# Altium project PCB_Project_1.PrjPcb
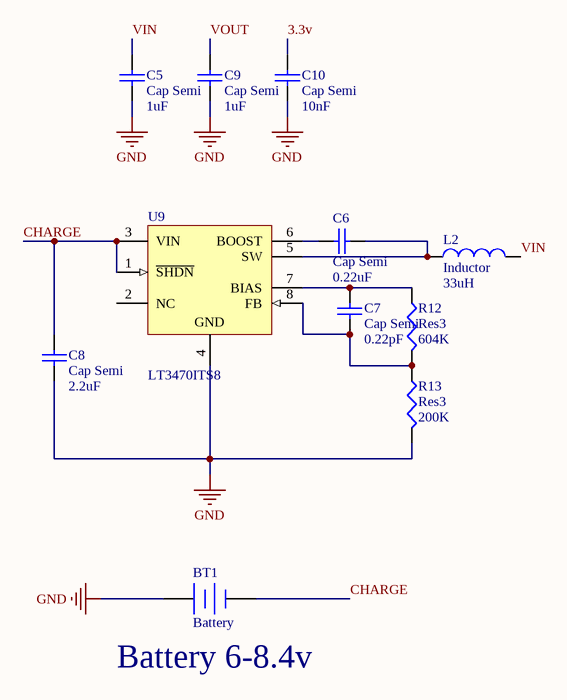
[diagram p0: 5v and Filters.SchDoc]
3 sheets, 52 parts. Net scope: global (net labels, ports and power ports of the same name join across sheets).
Board file: Breakout.PcbDoc
Sheets:
  5v and Filters.SchDoc
  PocketPilot.SchDoc
  MPPT.SchDoc

## Sheet 5v and Filters.SchDoc
size A4; SheetNumber: 1; SheetTotal: 3

### Parts
BT1  Battery  [BAT-2]
C5  Cap Semi  value 1uF  [C1206]
C6  Cap Semi  value 0.22uF  [C1206]
C7  Cap Semi  value 0.22pF  [C1206]
C8  Cap Semi  value 2.2uF  [C1206]
C9  Cap Semi  value 1uF  [C1206]
C10  Cap Semi  value 10nF  [C1206]
L2  Inductor  value 33uH  [0402-A]
R12  Res3  value 604K  [J1-0603]
R13  Res3  value 200K  [J1-0603]
U9  LT3470ITS8  [LT-TS8-8-TSOT-23_V]

### Nets
GND: BT1.1(+) C5.1 C8.2 C9.1 C10.1 R13.2 U9.4(GND)
3.3v: C10.2
CHARGE: BT1.2(-) C8.1 U9.1(~{SHDN}) U9.3(VIN)
VIN: C5.2 L2.2
VOUT: C9.2
NetC6_1: C6.1 U9.6(BOOST)
NetC6_2: C6.2 L2.1 U9.5(SW)
NetC7_1: C7.1 R12.1 U9.7(BIAS)
NetC7_2: C7.2 R12.2 R13.1 U9.8(FB)

Not connected (* = marked no-connect by the designer): U9 2(NC)

### Notes on the sheet
- (near BT1) Battery 6-8.4v

### Library data of the parts
BT1 = Battery: Multicell Battery; Published: 24-Mar-1999; LatestRevisionDate: 17-Jul-2002; LatestRevisionNote: Re-released for DXP Platform.; PackageReference: BAT-2; Publisher: Altium Limited; PackageDescription: Battery; 2 Leads
C5-C10 = Cap Semi: Capacitor (Semiconductor SIM Model); Published: 8-Jun-2000; LatestRevisionDate: 29-May-2009; LatestRevisionNote: IPC-7351 Footprint Added.; PackageReference: C1206; Publisher: Altium Limited; PackageDescription: Chip Capacitor
L2 = Inductor: Code_IEC: 1005; Published: 8-Jun-2000; LatestRevisionDate: 29-May-2009; LatestRevisionNote: IPC-7351 Footprint Added.; PackageReference: 0402-A; Publisher: Altium Limited; PackageDescription: Chip Inductor; Code_JEITA: 0402
R12 R13 = Res3: Resistor; Published: 8-Jun-2000; LatestRevisionDate: 29-May-2009; LatestRevisionNote: IPC-7351 Footprint Added.; PackageReference: J1-0603; Publisher: Altium Limited; PackageDescription: Chip Resistor
U9 = CMP-0491-02134-1: Micropower Buck Regulator with Integrated Boost and Catch Diode, 8-pin SOT23 (TS8-8), -40 to 125 degC; Manufacturer: Linear Technology; Number of Outputs: 1; PackageVersion: Rev. A, 08/2010; ComponentLink1Description: Manufacturer URL; PartNumber: LT3470ITS8; DatasheetVersion: Rev. D; ComponentLink3Description: Package Specification; ComponentLink3URL: http://cds.linear.com/docs/en/packaging/SOT_8_05-08-1637.pdf; ComponentLink2URL: http://cds.linear.com/docs/en/datasheet/3470fd.pdf; PackageDescription: 8-Pin Plastic TSOT-23, Body 2.9 x 1.63 mm, Pitch 0.65 mm; PackageReference: TS8-8; ComponentLink2Description: Datasheet; ComponentLink1URL: http://www.linear.com/; Code_JEDEC: MO-193; Mounting Technology: Surface Mount; RoHS: FALSE

## Sheet PocketPilot.SchDoc
size A4; SheetNumber: 2; SheetTotal: 3
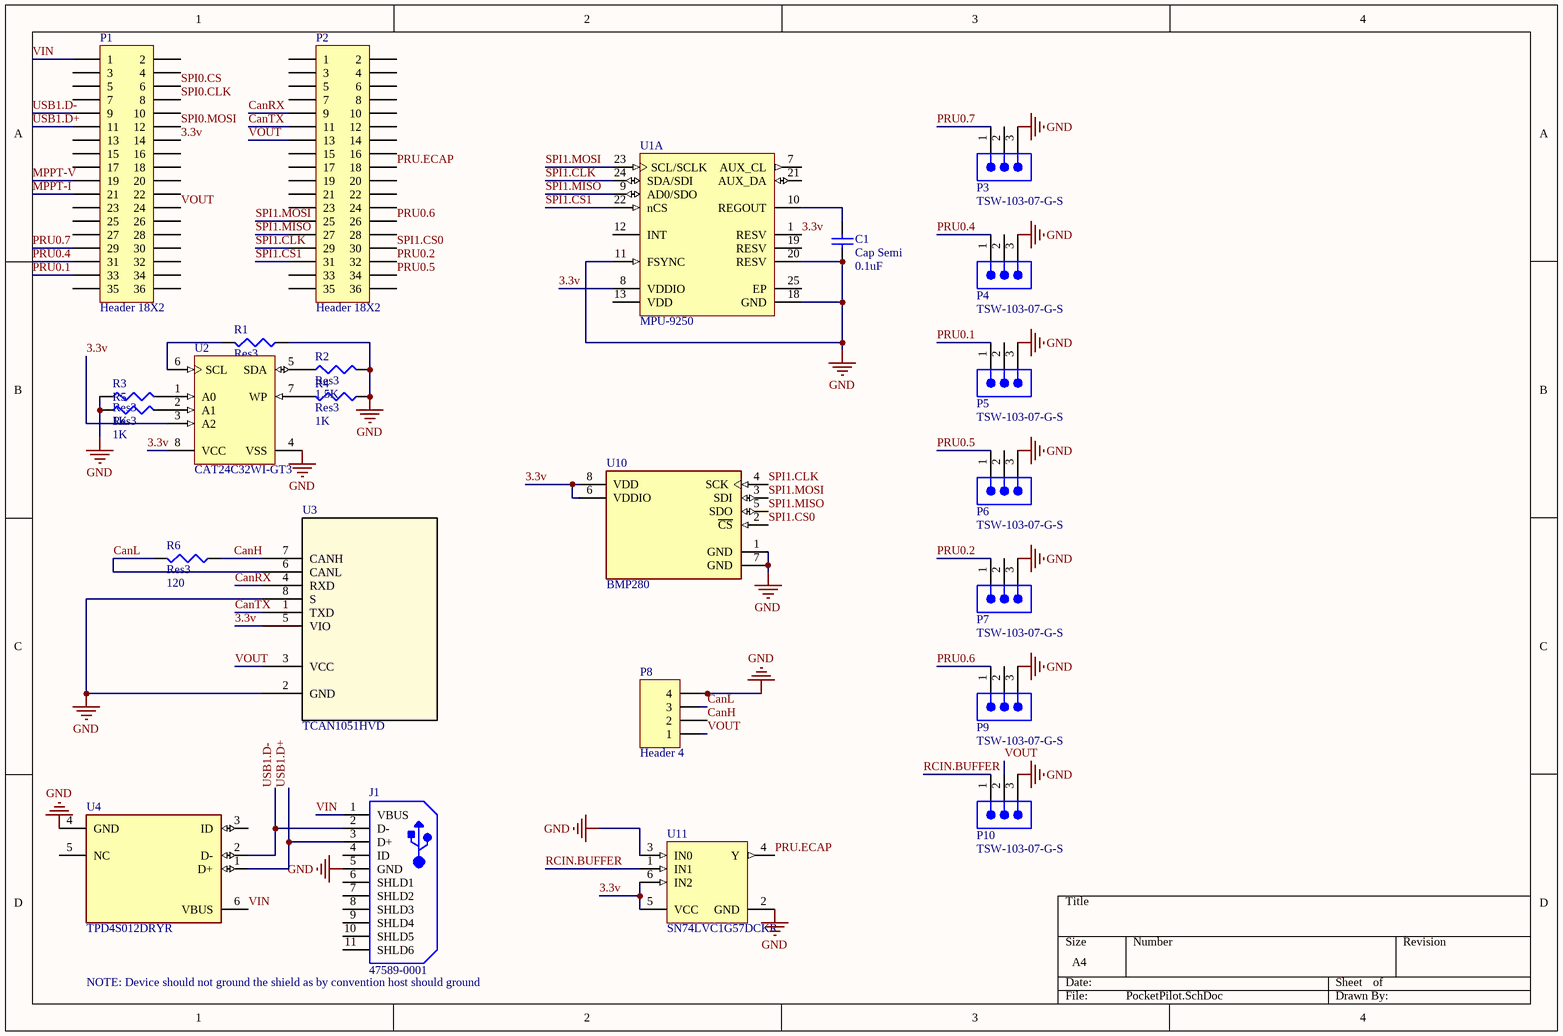
[diagram p1: PocketPilot.SchDoc]

### Parts
C1  Cap Semi  value 0.1uF  [C1206]
J1  47589-0001  [MOLX-47589-0001_V]
P1  Header 18X2  [HDR2X18]
P2  Header 18X2  [HDR2X18]
P3  TSW-103-07-G-S  [SMTC-TSW-103-07-X-S]
P4  TSW-103-07-G-S  [SMTC-TSW-103-07-X-S]
P5  TSW-103-07-G-S  [SMTC-TSW-103-07-X-S]
P6  TSW-103-07-G-S  [SMTC-TSW-103-07-X-S]
P7  TSW-103-07-G-S  [SMTC-TSW-103-07-X-S]
P8  Header 4  [HDR1X4]
P9  TSW-103-07-G-S  [SMTC-TSW-103-07-X-S]
P10  TSW-103-07-G-S  [SMTC-TSW-103-07-X-S]
R1  Res3  value 1.5K  [J1-0603]
R2  Res3  value 1.5K  [J1-0603]
R3  Res3  value 1K  [J1-0603]
R4  Res3  value 1K  [J1-0603]
R5  Res3  value 1K  [J1-0603]
R6  Res3  value 120  [J1-0603]
U1  MPU-9250  [INSE-QFN-24-1700X1540TP_M]  (part A of 2)
U2  CAT24C32WI-GT3  [ONSC-SOIC-8-751BD-01_M]
U3  TCAN1051HVD  [D8_TEX]
U4  TPD4S012DRYR  [FP-DRY0006A-MFG]
U10  BMP280  [FP-BMP280-MFG]
U11  SN74LVC1G57DCKR  [DCK0006A_N]

### Nets
GND: C1.1 J1.5(GND) P3.3 P4.3 P5.3 P6.3 P7.3 P8.4 P9.3 P10.3 R1.1 R2.2 R3.1 R4.1 R5.1 U1.11(FSYNC) U1.18(GND) U1.20(RESV) U2.4(VSS) U3.2(GND) U3.8(S) U4.4(GND) U10.1(GND) U10.7(GND) U11.2(GND) U11.3(IN0)
3.3v: P1.14 U1.1(RESV) U1.8(VDDIO) U2.3(A2) U2.8(VCC) U3.5(VIO) U10.6(VDDIO) U10.8(VDD) U11.5(VCC) U11.6(IN2)
CanH: P8.2 R6.1 U3.7(CANH)
CanL: P8.3 R6.2 U3.6(CANL)
CanRX: P2.9 U3.4(RXD)
CanTX: P2.11 U3.1(TXD)
MPPT-I: P1.21
MPPT-V: P1.19
PRU0.1: P1.33 P5.1
PRU0.2: P2.32 P7.1
PRU0.4: P1.31 P4.1
PRU0.5: P2.34 P6.1
PRU0.6: P2.26 P9.1
PRU0.7: P1.29 P3.1
PRU.ECAP: P2.18 U11.4(Y)
RCIN.BUFFER: P10.1 U11.1(IN1)
SPI0.CLK: P1.8
SPI0.CS: P1.6
SPI0.MOSI: P1.12
SPI1.CLK: P2.29 U1.24(SDA/SDI) U10.4(SCK)
SPI1.CS0: P2.30 U10.2(~{CS})
SPI1.CS1: P2.31 U1.22(nCS)
SPI1.MISO: P2.27 U1.9(AD0/SDO) U10.5(SDO)
SPI1.MOSI: P2.25 U1.23(SCL/SCLK) U10.3(SDI)
USB1.D+: J1.3(D+) P1.11 U4.1(D+)
USB1.D-: J1.2(D-) P1.9 U4.2(D-)
VIN: J1.1(VBUS) P1.1 U4.6(VBUS)
VOUT: P1.24 P2.13 P8.1 P10.2 U3.3(VCC)
NetC1_2: C1.2 U1.10(REGOUT)
NetR1_2: R1.2 U2.6(SCL)
NetR2_1: R2.1 U2.5(SDA)
NetR3_2: R3.2 U2.1(A0)
NetR4_2: R4.2 U2.7(WP)
NetR5_2: R5.2 U2.2(A1)

Not connected (* = marked no-connect by the designer): J1 4(ID) 6(SHLD1) 7(SHLD2) 8(SHLD3) 9(SHLD4) 10(SHLD5) 11(SHLD6); P1 2 3 4 5 7 10 13 15 16 17 18 20 22 23 25 26 27 28 30 32 34 35 36; P2 1 2 3 4 5 6 7 8 10 12 14 15 16 17 19 20 21 22 23 24 28 33 35 36; P3 2; P4 2; P5 2; P6 2; P7 2; P9 2; U1 7(AUX_CL) 12(INT) 13(VDD) 19(RESV) 21(AUX_DA) 25(EP); U4 3(ID) 5(NC)

### Notes on the sheet
- (near J1) NOTE: Device should not ground the shield as by convention host should ground

### Library data of the parts
C1 = Cap Semi: Capacitor (Semiconductor SIM Model); Published: 8-Jun-2000; LatestRevisionDate: 29-May-2009; LatestRevisionNote: IPC-7351 Footprint Added.; PackageReference: C1206; Publisher: Altium Limited; PackageDescription: Chip Capacitor
J1 = CMP-2000-05610-1: Right Angle Female Type AB Micro USB Connector, 30 V, 1.8 A, -30 to 85 degC, RoHS, Tape and Reel; Number of Ports: 1Port; Current Rating: 1.8A; Brand: Molex; Connector Type: MicroUSBTypeABreceptacle; Number of Contacts: 5Contact; Voltage Rating: 30VAC; Color: Black; Product: MicroUSBTypeABConnectors; Package URL: http://www.molex.com/pdm_docs/sd/475890001_sd.pdf; Contact Plating: Gold; Datasheet URL: http://www.molex.com/webdocs/datasheets/pdf/en-us/0475890001_IO_CONNECTORS.pdf; Operating Temperature Range: -20Cto+85C; Termination Style: SMD/SMT; Mounting Angle: Right; Package Reference: 47589-0001; Gender: Female; Package Description: Micro USB Connector, Pitch 0.65 mm, 5 Positions, Body 7.5 x 5.6 mm; Mounting Technology: SurfaceMount; Contact Material: CopperAlloy; Packaging: Reel; RoHS: True; Standard: USB; Manufacturer URL: http://www.molex.com/; Manufacturer: Molex; Datasheet Version: 12/2016; Product Category: USBConnectors; Series: 47589
P1 P2 = Header 18X2: Header, 18-Pin, Dual row; LatestRevisionDate: 17-Jul-2002; LatestRevisionNote: Re-released for DXP Platform.; Publisher: Altium Limited
P3-P7 P9 P10 = CMP-1024-00333-1: 0.025" SQ Post Header, Through-hole, Vertical, -55 to 125 degC, 2.54 mm Pitch, 3-Pin, Male, RoHS; Manufacturer: Samtec; Pitch: 2.54 mm; ComponentLink3URL: http://www.samtec.com/documents/webfiles/cpdf/TSW-XXX-XX-XXX-X-XX-XXX-MKT.pdf; Temperature Range: -55 to 125 degC; DatasheetVersion: F-214; ComponentLink1Description: Manufacturer URL; ComponentLink2URL: http://www.samtec.com/documents/webfiles/pdf/TSW_TH.PDF; RoHS: True; Orientation: Vertical; ComponentLink2Description: Datasheet; ComponentLink3Description: Package Specification; PackageDescription: .025[0.64] SQ. Post Terminal Strip Assembly; Mounting Technology: Through-hole; PackageVersion: DM, 8/1988; ComponentLink1URL: http://www.samtec.com; PackageReference: TSW-103-07-X-S; PartNumber: TSW-103-07-G-S
P8 = Header 4: Header, 4-Pin; LatestRevisionDate: 17-Jul-2002; LatestRevisionNote: Re-released for DXP Platform.; Publisher: Altium Limited
R1-R6 = Res3: Resistor; Published: 8-Jun-2000; LatestRevisionDate: 29-May-2009; LatestRevisionNote: IPC-7351 Footprint Added.; PackageReference: J1-0603; Publisher: Altium Limited; PackageDescription: Chip Resistor
U1 = CMP-2100-03657-1: 9-axis MotionTracking device, 2.4 to 3,6 V, -40 to 85 degC, 24-Pin QFN, RoHS, Tape and Reel; Manufacturer: InvenSense; Max Supply Voltage: 3.6V; Min Supply Voltage: 2.4V; Package Reference: QFN-24; Package Quantity: 1; Datasheet Version: Rev. 1.0, 01/2014; Case/Package: QFN; Package Description: 24-Pin Quad Flat No-lead Package, Body 3 x 3 mm, Pitch 0.4 mm; Datasheet URL: http://datasheet.octopart.com/MPU-9250-InvenSense-datasheet-21859386.pdf; RoHSCompliant: true; Max Operating Temperature: 85degC; Height: 1mm; Mount: SurfaceMount; Manufacturer URL: http://www.invensense.com/; Width: 3.1mm; Min Operating Temperature: -40degC; Length: 3.1mm
U2 = CMP-1679-00009-1: I2C CMOS Serial EEPROM, 32 Kb, 1.7 to 5.5 V, -40 to 85 degC, 8-Pin SOIC (751BD), RoHS, Tape and Reel; Case\Package: TO-226-3; hFE Min: 100; Elements: 1; Max Power Dissipation: 625 mW; Frequency: 300 MHz; Vce Max: 1 V; ComponentLink1URL: http://www.onsemi.com/; Mount: Through Hole; REACH SVHC: No SVHC; Packaging: Bulk; Height: 5.33 mm; PackageDescription: 8-Pin Small Outline Integrated Circuit, Body 4.9 x 3.9 mm, Pitch 1.27 mm; ComponentLink2Description: Datasheet; DatasheetVersion: Rev. 24, 06/2015; ComponentLink1Description: Manufacturer URL; PackageReference: SOIC-8-751BD-01; Length: 5.2 mm; ComponentLink2URL: http://www.onsemi.com/pub_link/Collateral/CAT24C32-D.PDF; Pins: 3; Min Operating Temperature: -55 degC; ComponentLink3URL: http://www.onsemi.com/pub_link/Collateral/751BD.PDF; Weight: 0.006314 oz; Max Operating Temperature: 150 degC; Package Quantity: 1000; ComponentLink3Description: Package Specification; Width: 4.19 mm; RoHSCompliant: true; Radiation Hardening: No
U3 = TCAN1051HVD: No Description Available; SourceLibrary: TI_2019-05-11; Built_By: EMA_Molly; Vendor: Texas Instruments; Copyright: Copyright (C) 2018 Accelerated Designs. All rights reserved; Manufacturer_Part_Number: TCAN1051HVD; RefDes: RefDes; Type: DEV
U4 = CMP-0326-00038-4: TVS DIODE 5.5V 6SON; Breakdown Voltage: 24V; Interface: USB; ESD Protection: Yes; Peak Pulse Power: 60W; Number of Circuits: 4; Polarity: Unidirectional; Capacitance: 15pF; Test Current: 1mA; Working Voltage: 19V; Min Breakdown Voltage: 6V; Peak Pulse Current: 3A; Operating Supply Voltage: 950mV; Max Operating Temperature: 85°C; Packaging: Tape and Reel; Termination: SMD/SMT; Number of Pins: 6; Radiation Hardening: No; Width: 1.05mm; REACH SVHC: No SVHC; Lead Free: Lead Free; Depth: 1mm; Package Quantity: 5000; Length: 1.45mm; Direction: Unidirectional; Min Operating Temperature: -40°C; Number of Channels: 4; Max Power Dissipation: 60W; Height: 0.55mm
U10 = CMP-2000-05076-3: SENSOR PRESSURE ABS; Operating Pressure: 15.95PSI; Pressure Type: Absolute; Output Type: SPI; Max Pressure: 290.08PSI; Port Style: No Port; Case/Package: SMD/SMT; Lead Free: Lead Free; Termination: SMD/SMT; Min Operating Temperature: -40°C; Number of Pins: 8; Max Operating Temperature: 85°C
U11 = CMP-0859-00501-3: CONFIGURABLE MULTIPLE-FUNCTION GATE, DCK0006A, LARGE T&R; Manufacturer: Texas Instruments; Logic: True; Voltage(Nom)(V): 1.8,2.5,3.3,5; VCC(Max)(V): 5.5; Sub-Family: Configurable Logic; tpd @ Nom Voltage(Max)(ns): 14.4,8.3,6.3,5.1; VCC(Min)(V): 1.65; Input Type: CMOS/TTL; Technology Family: LVC; 3-State Output: No; Rating: Catalog; Output Type: CMOS; ICC @ Nom Voltage(Max)(mA): 0.01; Output Drive (IOL/IOH)(Max)(mA): 32/-32; F @ Nom Voltage(Max)(Mhz): 150; Bits(#): 1; PackageReference: DCK0006A; DatasheetVersion: SCES414O; Operating Temperature Range(C): -40 to 125; Generic Part Number: SN74LVC1G57; Schmitt Trigger: No; Gate Type: Configurable

## Sheet MPPT.SchDoc
size A4; SheetNumber: 3; SheetTotal: 3
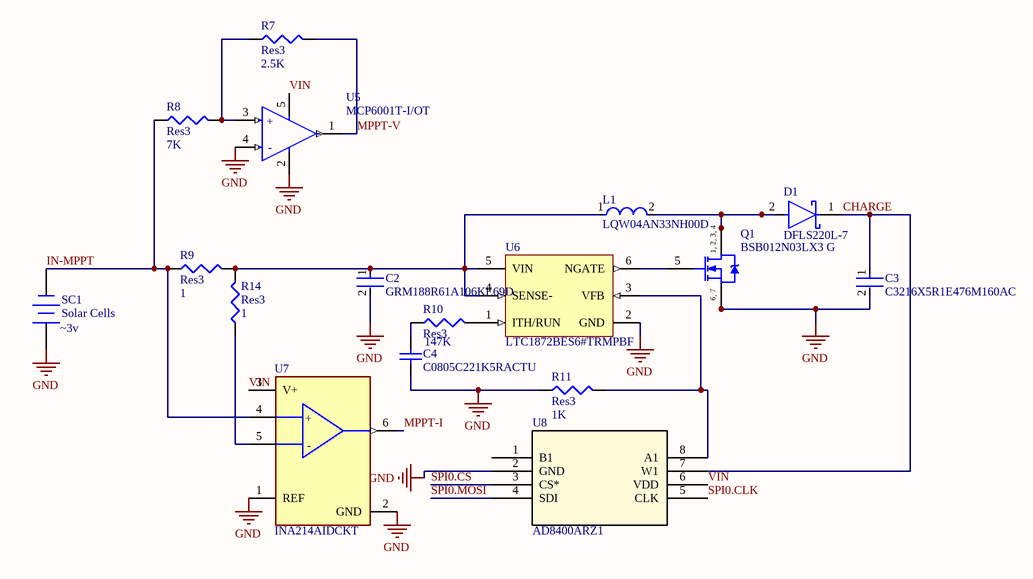
[diagram p2: MPPT.SchDoc]

### Parts
C2  GRM188R61A106KE69D  [FP-GRM18-0_15-MFG]
C3  C3216X5R1E476M160AC  [FP-C3216-160-MFG]
C4  C0805C221K5RACTU  [CAPC2013X88X50LL20T25]
D1  DFLS220L-7  [FP-PowerDI123-MFG]
L1  LQW04AN33NH00D  [FP-LQW04AN_00-MFG]
Q1  BSB012N03LX3 G  [INF-MG-WDSON-2-8_V]
R7  Res3  value 2.5K  [J1-0603]
R8  Res3  value 7K  [J1-0603]
R9  Res3  value 1  [J1-0603]
R10  Res3  value 147K  [J1-0603]
R11  Res3  value 1K  [J1-0603]
R14  Res3  value 1  [J1-0603]
SC1  Solar Cells  [BAT-2]
U5  MCP6001T-I/OT  [FP-C04-091-OT-IPC_A]
U6  LTC1872BES6#TRMPBF  [LT-S6-6-TSOT-23_L]
U7  INA214AIDCKT  [FP-DCK0006A-MFG]
U8  AD8400ARZ1  [R_8_ADI]

### Nets
GND: C2.2 C3.2 C4.1 Q1.6(SOURCE) Q1.7(SOURCE) R11.1 SC1.1(+) U5.2(VSS) U5.4(VIN-) U6.2(GND) U7.1(REF) U7.2(GND) U8.2(GND)
CHARGE: C3.1 D1.1(C) U8.7(W1)
IN-MPPT: R8.1 R9.1 SC1.2(-) U7.4(IN+)
MPPT-I: U7.6(OUT)
MPPT-V: R7.2 U5.1(VOUT)
SPI0.CLK: U8.5(CLK)
SPI0.CS: U8.3(CS*)
SPI0.MOSI: U8.4(SDI)
VIN: U5.5(VDD) U7.3(V+) U8.6(VDD)
NetC2_1: C2.1 L1.1 R9.2 R14.2 U6.4(SENSE-) U6.5(VIN)
NetC4_2: C4.2 R10.1
NetD1_2: D1.2(A) L1.2 Q1.1(DRAIN) Q1.2(DRAIN) Q1.3(DRAIN) Q1.4(DRAIN)
NetQ1_5: Q1.5(GATE) U6.6(NGATE)
NetR7_1: R7.1 R8.2 U5.3(VIN+)
NetR10_2: R10.2 U6.1(ITH/RUN)
NetR11_2: R11.2 U6.3(VFB) U8.8(A1)
NetR14_1: R14.1 U7.5(IN-)

Not connected (* = marked no-connect by the designer): U8 1(B1)

### Notes on the sheet
- (near SC1) ~3v
- (in symbol CMP-0187-00462-3) +; -
- (in symbol CMP-1090-00012-1) 1, 2, 3, 4; 6, 7
- (in symbol CMP-2000-06456-2) +; -

### Library data of the parts
C2 = CMP-2000-05448-2: CAP CER 10UF 10V X5R 0603; Manufacturer: Murata; Temperature Coefficient: 15%; Material: Ceramic; Tolerance: 10%; Device Class L1: Passive Components; ComponentLink2Description: Datasheet; Height: 0.95mm; Package: GRM18-0.15; Octopart: https://octopart.com/grm188r61a106ke69d-murata-22851381; Manufacturer Part Number: GRM188R61A106KE69D; Value: 10uF; Digikey Description: CAP CER 10UF 10V X5R 0603; Temperature Range High: +85°C; Temperature Range Low: -55°C; Temperature Characteristic: X5R; Capacitance: 10uF; RoHS: TRUE; Device Class L2: Capacitors; ComponentLink2URL: https://search.murata.co.jp/Ceramy/image/img/A01X/G101/ENG/GRM188R61A106KE69-01A.pdf; Device Class L3: Ceramic Capacitors; Lead Free: Yes; Mouser Description: Multilayer Ceramic Capacitors MLCC - SMD/SMT 0603 10uF 10volts X5R + - 10%; Category: Cap; Voltage Rating: 10V; Temperature: -55°C to +85°C; Automotive: No
C3 = CMP-2000-05397-2: CAP CER 47UF 25V X5R 1206; 3DS Part Number: 220-00004; Manufacturer: TDK; Temperature Coefficient: 15%; Tolerance: 20%; Material: Ceramic; Height: 1.8mm; Device Class L1: Passive Components; Temperature Characteristic: X5R; Voltage: 25V; Digikey Description: CAP CER 47UF 25V X5R 1206; Voltage Rating: 25V; ComponentLink2URL: https://product.tdk.com/info/en/catalog/datasheets/mlcc_commercial_general_en.pdf; Category: Cap; Capacitance: 47uF; Ipc Land Pattern Name: CAPC320160X160; Temperature Range High: +85°C; ComponentLink2Description: Datasheet; Temperature: -55°C to +85°C; Mouser Description: Multilayer Ceramic Capacitors MLCC - SMD/SMT 1206 47uF 25volts X5R 20%; Lead Free: Yes; RoHS: TRUE; Device Class L2: Capacitors; Device Class L3: Ceramic Capacitors; Manufacturer Part Number: C3216X5R1E476M160AC; Automotive: No; Temperature Range Low: -55°C; Footprint Url: https://product.tdk.com/info/en/catalog/spec/mlccspec_commercial_general_midvoltage_en.pdf; Value: 47uF; Octopart: https://octopart.com/c3216x5r1e476m160ac-tdk-25947783; Package: C3216-160
C4 = CMP-2007-00321-1: Manufacturer: Kemet; Part Number: C0805C221K5RACTU
D1 = CMP-12790-000030-1: DIODE SCHOTTKY 20V 2A POWERDI123; Manufacturer: Diodes Inc.; Capacitance: 75pF; Max Junction Temp: +125°C; Max Surge Forward Current: 40A; Peak Reverse Current: 1mA; Value: 75pF; Package: PowerDI123; Temperature: -55°C to +125°C; ComponentLink2Description: Datasheet; RoHS: TRUE; Category: Diode; Digikey Description: DIODE SCHOTTKY 20V 2A POWERDI123; Temperature Range Low: -55°C; Mouser Description: DFLS220L Series 20 V 2 A Surface Mount Schottky Barrier Rectifier - PowerDI-123; Device Class L3: Schottky Diodes; Device Class L2: Diodes; Device Class L1: Discrete Semiconductors; Manufacturer Part Number: DFLS220L-7; Reverse Voltage: 20V; Max Repetitive Reverse Voltage: 20V; Octopart: https://octopart.com/dfls220l-7-diodes+inc.-328575; Temperature Range High: +125°C; Automotive: No; Forward Current: 2A; Footprint Url: https://www.diodes.com/assets/Package-Files/PowerDI123.pdf; Lead Free: Yes; ComponentLink2URL: https://www.diodes.com/assets/Datasheets/ds30517.pdf; Height: 1mm
L1 = CMP-06042-000403-1: Wire Wound RF Inductor 33nH ±3% 140mA 1.11Ω 03015 (0804); Q Factor: 15; Test Frequency: 100MHz; Self Resonant Frequency: 4GHz; DC Resistance (DCR): 1.11R; Shielding: Unshielded; Core Material: Ferrite; Case Code (Metric): 0804; Tolerance: 3%; Military Standard: Not; Current Rating: 140mA; Max DC Current: 140mA; Case Code (Imperial): 3015; Termination: SMD/SMT; Depth: 0.45mm; Package Quantity: 10000; DC Current: 140mA; Min Operating Temperature: -55°C; Case/Package: Nonstandard; Packaging: Tape and Reel; Mount: Surface Mount; Max Operating Temperature: 125°C; Lead Free: Lead Free; Height - Seated (Max): 0.018inch; Weight: 1.1E-05oz; Height: 0.4mm; Length: 0.8mm; Width: 0.016inch; Inductance: 33nH
Q1 = CMP-1090-00012-1: N-Channel OptiMOS 3 Power-MOSFET, 30 V VDS, 180 A ID, -40 to 150 degC, MG-WDSON-2-8, Reel, Green; Manufacturer: Infineon; Rth: 1.4Â K/W; VGS(th) (min): 1Â V; IDpuls (max): 400Â A; Ptot (max): 89Â W; RthJA (max): 45 K/W; RDS (on) (max): 1.2Â mOhm; RthJC (max): 1.4 K/W; VDS (max): 30Â V; QG: 127Â nC; ID (max): 180Â A; RDS (on) (max) (@4.5V): 1.8Â mOhm; Polarity: N; Green: TRUE; VGS(th) (max): 2.2Â V; ComponentLink2URL: http://www.infineon.com/dgdl/BSB012N03LX3+G_Rev_+2.1_pdf.pdf?folderId=db3a304313b8b5a60113cee8763b02d7&fileId=db3a304320d39d590121a0112ce07a8b; PackageVersion: Jun-09; ComponentLink3URL: http://www.infineon.com/dgdl/MG-WDSON-2-MX-Package_Overview.pdf?folderId=db3a30431f848401011fb8316d98599f&fileId=db3a30431f848401011fb8a9e1645a0a; ComponentLink1URL: http://www.infineon.com/; PackageReference: MG-WDSON-2-8; PackageDescription: 7-Pin Metal Green Very Very Thin Profile Dual Small Outline Non-leaded Package; Halogen-free: TRUE; Packing: Reel; ComponentLink3Description: Package Specification; DatasheetVersion: Rev. 2.1; PartNumber: BSB012N03LX3 G; Mounting Technology: Surface Mount; ComponentLink1Description: Manufacturer URL; ComponentLink2Description: Datasheet
R7-R11 R14 = Res3: Resistor; Published: 8-Jun-2000; LatestRevisionDate: 29-May-2009; LatestRevisionNote: IPC-7351 Footprint Added.; PackageReference: J1-0603; Publisher: Altium Limited; PackageDescription: Chip Resistor
SC1 = Battery: Multicell Battery; Published: 24-Mar-1999; LatestRevisionDate: 17-Jul-2002; LatestRevisionNote: Re-released for DXP Platform.; PackageReference: BAT-2; Publisher: Altium Limited; PackageDescription: Battery; 2 Leads
U5 = CMP-0187-00462-3: IC OPAMP GP 1 CIRCUIT SOT23-5; Number of Amplifiers: 1; Voltage: 6V; Power Supply Rejection Ratio (PSRR): 86dB; Common Mode Rejection Ratio: 60dB; Unity Gain Bandwidth Product: 1MHz; Slew Rate: 0.6V/µs; Output Current per Channel: 23mA; Nominal Supply Current: 100uA; Input Offset Voltage (Vos): 4.5mV; Input Bias Current: 1pA; Operating Supply Voltage: 5.5V; Min Supply Voltage: 1.8V; Voltage Gain: 112dB; Length: 3.1mm; REACH SVHC: No SVHC; Number of Pins: 5; Package Quantity: 1; Radiation Hardening: No; Mount: Surface Mount; Number of Circuits: 1; Number of Elements: 1; Output Current: 23mA; Packaging: Tape and Reel; Height: 1.3mm; Lead Free: Lead Free; Min Operating Temperature: -40°C; Bandwidth: 1MHz; Contact Plating: Tin; Max Supply Voltage: 6V; Max Operating Temperature: 85°C; Width: 1.8mm; Case/Package: SOT-23; Operating Supply Current: 100uA; Number of Channels: 1; Gain Bandwidth Product: 1MHz
U6 = CMP-0492-01790-1: Constant Frequency Current Mode Step-Up DC/DC Controller, 6-pin SOT23 (S6-6), -40 to 85 degC, Pb-Free, Mini Tape and Reel; Manufacturer: Linear Technology; Number of Outputs: 1; RoHS: TRUE; PackageReference: S6-6; ComponentLink2URL: http://cds.linear.com/docs/en/datasheet/1872bf.pdf; Packing: Mini Tape and Reel; Mounting Technology: Surface Mount; Code_JEDEC: MO-193; ComponentLink1URL: http://www.linear.com/; ComponentLink3Description: Package Specification; PackageDescription: 6-Pin Plastic TSOT-23, Body 2.9 x 1.63 mm, Pitch 0.95 mm; PartNumber: LTC1872BES6#TRMPBF; ComponentLink2Description: Datasheet; PackageVersion: Jun-10; ComponentLink3URL: http://cds.linear.com/docs/en/packaging/SOT_6_05-08-1636.pdf; ComponentLink1Description: Manufacturer URL
U7 = CMP-2000-06456-2: IC CURR SENSE 1 CIRCUIT SC70-6; Manufacturer: Texas Instruments; Voltage Gain: 0.1V/mV; Max Supply Voltage: 26V; Bandwidth: 30kHz; Number Of Channels: 1; Min Supply Voltage: 2.7V; Nominal Supply Current: 65uA; Max Junction Temp: +150°C; Input Offset Voltage: 0.001mV; Standoff Height: 0mm; Input Bias Current: 28uA; Device Class L1: Integrated Circuits (ICs); Device Class L2: Linear ICs; Height: 1.1mm; Temperature Range High: +125°C; Package: DCK0006A; RoHS: TRUE; Temperature: -40°C to +125°C; Automotive: No; Manufacturer Part Number: INA214AIDCKT; Device Class L3: Instrumentation; Mouser Description: Current Sense Amplifiers Hi/Lo-Side Bi-Dir 0- Drift Ser Crnt Shunt; Digikey Description: IC CURR SENSE 1 CIRCUIT SC70-6; ComponentLink2Description: Datasheet; Lead Free: Yes; Ambient Temperature Range High: +125°C; Temperature Range Low: -40°C; ComponentLink2URL: http://www.ti.com/lit/ds/symlink/ina214.pdf; Octopart: https://octopart.com/ina214aidckt-texas+instruments-7830703; Ambient Temperature Range Low: -40°C; Category: IC
U8 = AD8400ARZ1: No Description Available; SourceLibrary: Analog_2012-01-01_5; Built_By: EMA_UL_Team; Vendor: Analog Devices Inc; Manufacturer_Part_Number: AD8400ARZ1; Copyright: Copyright (C) 2018 Accelerated Designs. All rights reserved; RefDes: RefDes; Type: DEV

## Nets that join several sheets
GND: 5v and Filters (7 pins), PocketPilot (26 pins), MPPT (13 pins)
3.3v: 5v and Filters (C10.2), PocketPilot (10 pins)
CHARGE: 5v and Filters (BT1.2 C8.1 U9.1 U9.3), MPPT (C3.1 D1.1 U8.7)
MPPT-I: PocketPilot (P1.21), MPPT (U7.6)
MPPT-V: PocketPilot (P1.19), MPPT (R7.2 U5.1)
SPI0.CLK: PocketPilot (P1.8), MPPT (U8.5)
SPI0.CS: PocketPilot (P1.6), MPPT (U8.3)
SPI0.MOSI: PocketPilot (P1.12), MPPT (U8.4)
VIN: 5v and Filters (C5.2 L2.2), PocketPilot (J1.1 P1.1 U4.6), MPPT (U5.5 U7.3 U8.6)
VOUT: 5v and Filters (C9.2), PocketPilot (5 pins)